# Altium schematic sheet [9] ADC_Acquisition.SchDoc: =DocumentName
size A3; Organization: ORGANIZATION; Address1: R. Aprígio Veloso, 882, Universitário; Address2: Campina Grande - PB; Address3: 58429-900; DocumentNumber: 9; Revision: -; SheetNumber: 9; SheetTotal: 11; ENG_DATE: --/--/--; DSN_DATE: --/--/--; CHK_DATE: --/--/--; SCH_SCALE: 1:1
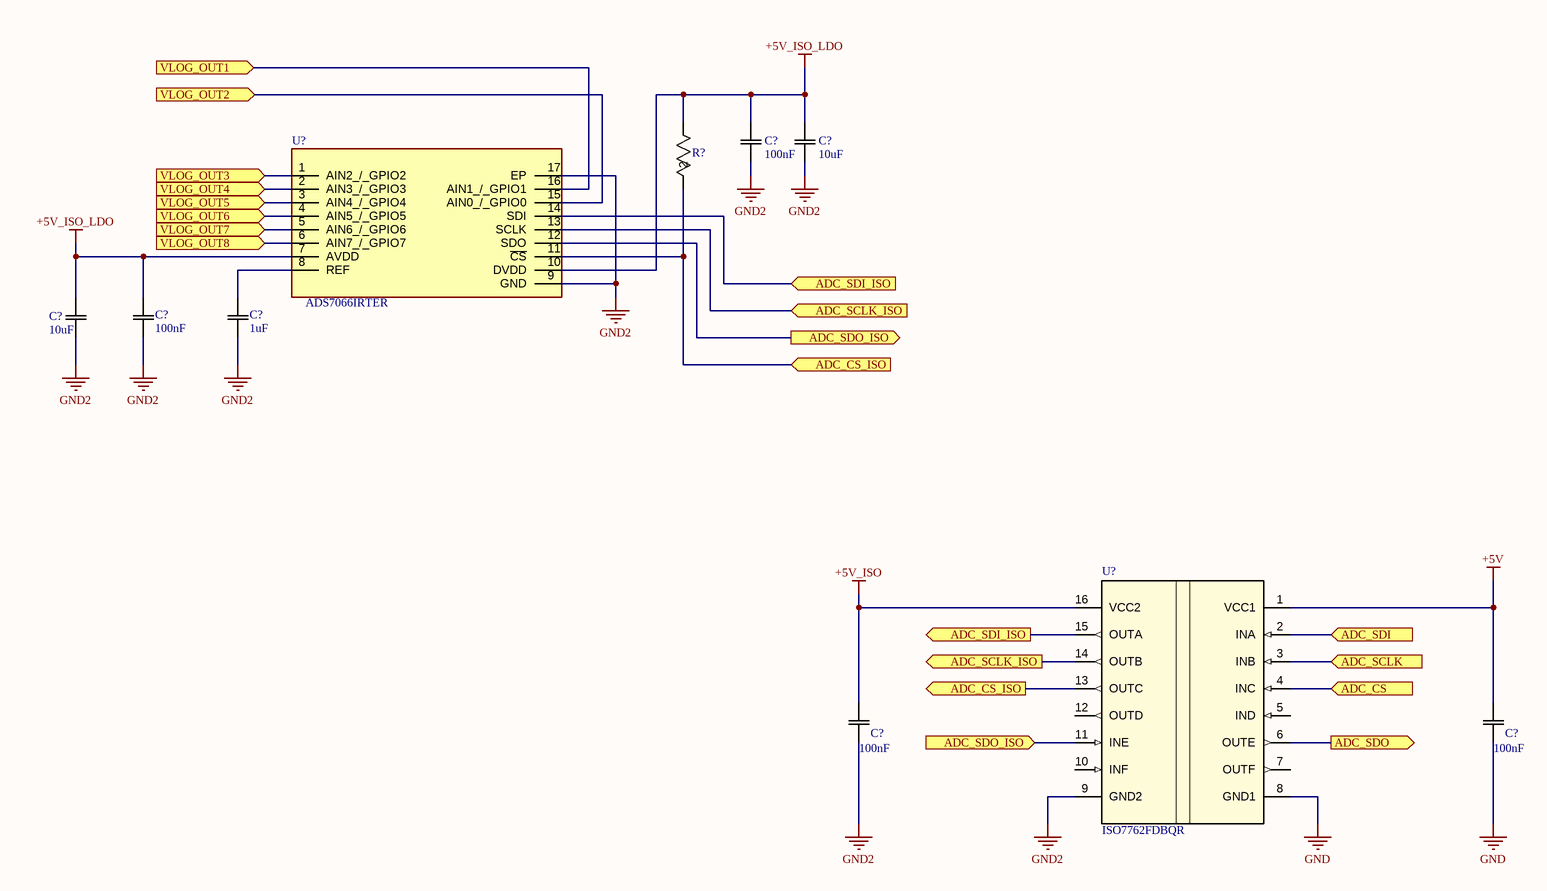
[diagram p0: [9] ADC_Acquisition.SchDoc]

## Parts
(Parts that share a designator on the sheet are numbered #1, #2 ... from top to bottom, then left to right.)
C?#1  value 100nF  [CAP_GCM15_MUR]  (hidden comment: GCM155R71H104KE02D)
C?#2  value 10uF  [G-155_MUR]  (hidden comment: GRM155R61A102KA01D)
C?#3  value 10uF  [G-155_MUR]  (hidden comment: GRM155R61A102KA01D)
C?#4  value 100nF  [CAP_GCM15_MUR]  (hidden comment: GCM155R71H104KE02D)
C?#5  value 1uF  [CAP_GRM155Z_MUR]  (hidden comment: GRM155Z71A105KE01D)
C?#6  value 100nF  [CAP_GCM15_MUR]  (hidden comment: GCM155R71H104KE02D)
C?#7  value 100nF  [CAP_GCM15_MUR]  (hidden comment: GCM155R71H104KE02D)
R?  RC0402FR-0710KL  [RC0402N_YAG]  (value not drawn)
U?#1  ADS7066IRTER  [QFN50P300X300X80-17N-D]
U?#2  ISO7762FDBQR  [DBQ0016A_N]

## Ports
ADC_CS (in), ADC_CS_ISO (in), ADC_CS_ISO (out), ADC_SCLK (in), ADC_SCLK_ISO (in), ADC_SCLK_ISO (out), ADC_SDI (in), ADC_SDI_ISO (in), ADC_SDI_ISO (out), ADC_SDO (out), ADC_SDO_ISO (in), ADC_SDO_ISO (out), VLOG_OUT1 (in), VLOG_OUT2 (in), VLOG_OUT3 (in), VLOG_OUT4 (in), VLOG_OUT5 (in), VLOG_OUT6 (in), VLOG_OUT7 (in), VLOG_OUT8 (in)

## Nets
+5V: C?#7.2 U?#2.1(VCC1)
+5V_ISO: C?#6.2 U?#2.16(VCC2)
+5V_ISO_LDO: C?#1.2 C?#2.2 C?#3.2 C?#4.2 R?.1 U?#1.7(AVDD) U?#1.10(DVDD)
GND: C?#7.1 U?#2.8(GND1)
GND2: C?#1.1 C?#2.1 C?#3.1 C?#4.1 C?#5.1 C?#6.1 U?#1.9(GND) U?#1.17(EP) U?#2.9(GND2)
ADC_CS: U?#2.4(INC) ; port ADC_CS
ADC_CS_ISO: R?.2 U?#1.11(~{CS}) U?#2.13(OUTC) ; port ADC_CS_ISO
ADC_SCLK: U?#2.3(INB) ; port ADC_SCLK
ADC_SCLK_ISO: U?#1.13(SCLK) U?#2.14(OUTB) ; port ADC_SCLK_ISO
ADC_SDI: U?#2.2(INA) ; port ADC_SDI
ADC_SDI_ISO: U?#1.14(SDI) U?#2.15(OUTA) ; port ADC_SDI_ISO
ADC_SDO: U?#2.6(OUTE) ; port ADC_SDO
ADC_SDO_ISO: U?#1.12(SDO) U?#2.11(INE) ; port ADC_SDO_ISO
VLOG_OUT1: U?#1.16(AIN1_/_GPIO1) ; port VLOG_OUT1
VLOG_OUT2: U?#1.15(AIN0_/_GPIO0) ; port VLOG_OUT2
VLOG_OUT3: U?#1.1(AIN2_/_GPIO2) ; port VLOG_OUT3
VLOG_OUT4: U?#1.2(AIN3_/_GPIO3) ; port VLOG_OUT4
VLOG_OUT5: U?#1.3(AIN4_/_GPIO4) ; port VLOG_OUT5
VLOG_OUT6: U?#1.4(AIN5_/_GPIO5) ; port VLOG_OUT6
VLOG_OUT7: U?#1.5(AIN6_/_GPIO6) ; port VLOG_OUT7
VLOG_OUT8: U?#1.6(AIN7_/_GPIO7) ; port VLOG_OUT8
NetC?#5_2: C?#5.2 U?#1.8(REF)

Not connected (* = marked no-connect by the designer): U?#2 5(IND) 7(OUTF) 10(INF) 12(OUTD)

## Notes on the sheet
- REVISION
- DESCRIPTION
- DATE
- APPROVED
- ADDRESS
- PROJECT
- VERSION
- TITLE
- A3
- SIZE
- SCALE
- DOCUMENT NAME:
- DOCUMENT REVISION:
- OF
- SHEET:
- PROJECT REVISION:

## Library data of the parts
C?#1 C?#4 C?#6 C?#7 = GCM155R71H104KE02D: Description; Manufacturer_Name: Murata; Copyright: Copyright (C) 2026 Ultra Librarian. All rights reserved.; Manufacturer_Part_Number: GCM155R71H104KE02D
C?#2 C?#3 = GRM155R61A102KA01D: Description; Manufacturer_Name: Murata; Copyright: Copyright (C) 2026 Ultra Librarian. All rights reserved.; Manufacturer_Part_Number: GRM155R61A102KA01D
C?#5 = GRM155Z71A105KE01D: Description; Manufacturer_Name: Murata; Copyright: Copyright (C) 2025 Ultra Librarian. All rights reserved.; Manufacturer_Part_Number: GRM155Z71A105KE01D
R? = RC0402FR-0710KL: RES; SMT (0402); 10K; 1%; +/-100PPM/DEGC; 0.0630W; Manufacturer_Name: Yageo; Copyright: Copyright (C) 2025 Ultra Librarian. All rights reserved.; Manufacturer_Part_Number: RC0402FR-0710KL; Value: 10k
U?#1 = ADS7066IRTER: Analog to Digital Converters - ADC Eight-channel, 250-kSPS, 16-bit analog-to-digital converter with internal reference, GPIOs and SPI 16-WQFN -40 to 125; Manufacturer_Name: Texas Instruments; Geometry.Height: 0.8mm; Manufacturer_Part_Number: ADS7066IRTER; Mouser Part Number: 595-ADS7066IRTER; Mouser Price/Stock: https://www.mouser.co.uk/ProductDetail/Texas-Instruments/ADS7066IRTER?qs=ST9lo4GX8V1NXvZuWWBhPA%3D%3D; Arrow Part Number: ADS7066IRTER; Arrow Price/Stock: https://www.arrow.com/en/products/ads7066irter/texas-instruments.html?utm_currency=USD&region=nac; Datasheet Link: https://www.ti.com/lit/ds/symlink/ads7066.pdf?ts=1708383444470&ref_url=https%253A%252F%252Fwww.ti.com%252Fproduct%252FADS7066%253Futm_source%253Dgoogle%2526utm_medium%253Dcpc%2526utm_campaign%253Dasc-null-null-GPN_EN-cpc-pf-google-wwe%2526utm_content%253D
U?#2 = ISO7762FDBQR: Robust EMC, six-channel, 4/2, reinforced digital isolator 16-SSOP -55 to 125; Manufacturer_Name: Texas Instruments; TYPE: TYPE; RefDes: RefDes; Copyright: Copyright (C) 2025 Ultra Librarian. All rights reserved.; Manufacturer_Part_Number: ISO7762FDBQR